# Altium schematic sheet Inverter_Breakout.SchDoc: Inverter Breakout
size A4; Author: Chawthri K.; Organization: Waterloop; Address1: 200 University Ave W; Address2: Engineering 5, 1104; Address3: Waterloo, ON; Address4: N2L 3G1; Revision: 1; SheetNumber: 1; SheetTotal: 1
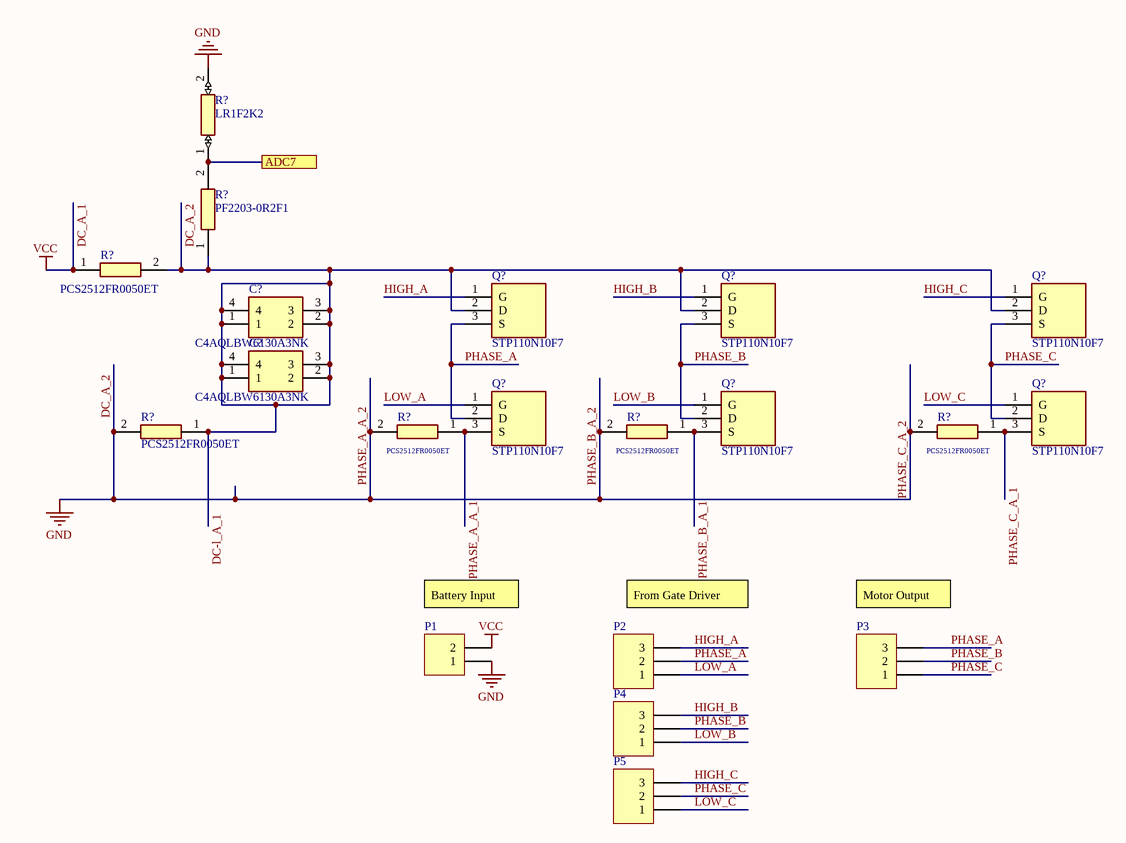
[diagram p0: Inverter_Breakout.SchDoc]

## Parts
(Parts that share a designator on the sheet are numbered #1, #2 ... from top to bottom, then left to right.)
C?#1  C4AQLBW6130A3NK  [C4AQLBW6130A3NK]
C?#2  C4AQLBW6130A3NK  [C4AQLBW6130A3NK]
P1  1x2 Header  [HDR1X2]  (value not drawn)
P2  1x3 Header  [HDR1X3]  (value not drawn)
P3  1x3 Header  [HDR1X3]  (value not drawn)
P4  1x3 Header  [HDR1X3]  (value not drawn)
P5  1x3 Header  [HDR1X3]  (value not drawn)
Q?#1  STP110N10F7  [TO255P460X1020X2008-3P]
Q?#2  STP110N10F7  [TO255P460X1020X2008-3P]
Q?#3  STP110N10F7  [TO255P460X1020X2008-3P]
Q?#4  STP110N10F7  [TO255P460X1020X2008-3P]
Q?#5  STP110N10F7  [TO255P460X1020X2008-3P]
Q?#6  STP110N10F7  [TO255P460X1020X2008-3P]
R?#1  LR1F2K2  [RESAD1540W55L620D230]
R?#2  PF2203-0R2F1  [TO508P470X1010X2030-2P]
R?#3  PCS2512FR0050ET  [RESC6430X66N]
R?#4  PCS2512FR0050ET  [RESC6430X66N]
R?#5  PCS2512FR0050ET  [RESC6430X66N]
R?#6  PCS2512FR0050ET  [RESC6430X66N]
R?#7  PCS2512FR0050ET  [RESC6430X66N]

## Ports
ADC7

## Nets
DC-l_A_1: C?#1.1 C?#1.2 C?#1.3 C?#1.4 C?#2.1 C?#2.2 C?#2.3 C?#2.4 P1.1 Q?#1.2(D) Q?#2.2(D) Q?#3.2(D) Q?#4.3(S) Q?#5.3(S) R?#1.2 R?#2.1 R?#3.2 R?#4.1 R?#4.2 R?#5.1 R?#5.2 R?#6.1 R?#6.2 R?#7.2  [also labelled DC_A_2, GND, PHASE_A_A_1, PHASE_A_A_2, PHASE_B_A_1, PHASE_B_A_2, PHASE_C_A_2]
DC_A_1: P1.2 R?#3.1  [also labelled VCC]
ADC7: R?#1.1 R?#2.2 ; port ADC7
HIGH_A: P2.3 Q?#1.1(G)
HIGH_B: P4.3 Q?#2.1(G)
HIGH_C: P5.3 Q?#3.1(G)
LOW_A: P2.1 Q?#4.1(G)
LOW_B: P4.1 Q?#5.1(G)
LOW_C: P5.1 Q?#6.1(G)
PHASE_A: P2.2 P3.3 Q?#1.3(S) Q?#4.2(D)
PHASE_B: P3.2 P4.2 Q?#2.3(S) Q?#5.2(D)
PHASE_C: P3.1 P5.2 Q?#3.3(S) Q?#6.2(D)
PHASE_C_A_1: Q?#6.3(S) R?#7.1

## Notes on the sheet
- (near P1) Battery Input
- (near P2) From Gate Driver
- (near P3) Motor Output
- Title:
- Size:
- Date:
- A4
- Author:
- Revision:
- Sheet
- of
- File:

## Library data of the parts
C?#1 C?#2 = C4AQLBW6130A3NK: Capacitor; Manufacturer_Name: Kemet; Datasheet Link: https://api.kemet.com/component-edge/download/specsheet/C4AQLBW6130A3NK.pdf; Height: 50.3mm; Manufacturer_Part_Number: C4AQLBW6130A3NK; Arrow Price/Stock: https://www.digikey.ca/en/products/detail/kemet/C4AQLBW6130A3NK/8345973; Mouser Part Number: C4AQLBW6130A3NK; Mouser Price/Stock: https://www.digikey.ca/en/products/detail/kemet/C4AQLBW6130A3NK/8345973; Arrow Part Number: C4AQLBW6130A3NK
P1 = 1x2 Header: 1x2 Pin Header
P2-P5 = 1x3 Header: 1x3 Pin Header
Q?#1-Q?#6 = STP110N10F7: Transistor; Manufacturer_Name: STMicroelectronics; Datasheet Link: http://www.st.com/web/en/resource/technical/document/datasheet/DM00072347.pdf; Height: 4.6mm; Manufacturer_Part_Number: STP110N10F7; Mouser Part Number: 511-STP110N10F7; Mouser Price/Stock: https://www.mouser.com/Search/Refine.aspx?Keyword=511-STP110N10F7
R?#1 = LR1F2K2: Resistor; Manufacturer_Name: TE Connectivity; Datasheet Link: https://componentsearchengine.com/Datasheets/2/LR1F2K2.pdf; Manufacturer_Part_Number: LR1F2K2; Mouser Part Number: 279-LR1F2K2; Mouser Price/Stock: https://www.mouser.com/Search/Refine.aspx?Keyword=279-LR1F2K2; Arrow Part Number: LR1F2K2; Arrow Price/Stock: https://www.arrow.com/en/products/lr1f2k2/te-connectivity
R?#2 = PF2203-0R2F1: Resistor; Manufacturer_Name: Riedon; Datasheet Link: https://riedon.com/media/pdf/PF2200.pdf; Height: 4.7mm; Manufacturer_Part_Number: PF2203-0R2F1
R?#3-R?#7 = PCS2512FR0050ET: Resistor; Manufacturer_Name: Ohmite; Datasheet Link: https://eu.mouser.com/datasheet/2/303/res_pcs-1665423.pdf; Height: 0.664mm; Manufacturer_Part_Number: PCS2512FR0050ET; Mouser Part Number: 588-PCS2512FR0050ET; Mouser Price/Stock: https://www.mouser.co.uk/ProductDetail/Ohmite/PCS2512FR0050ET?qs=Zz7%252BYVVL6bF35w7L3sqShw%3D%3D